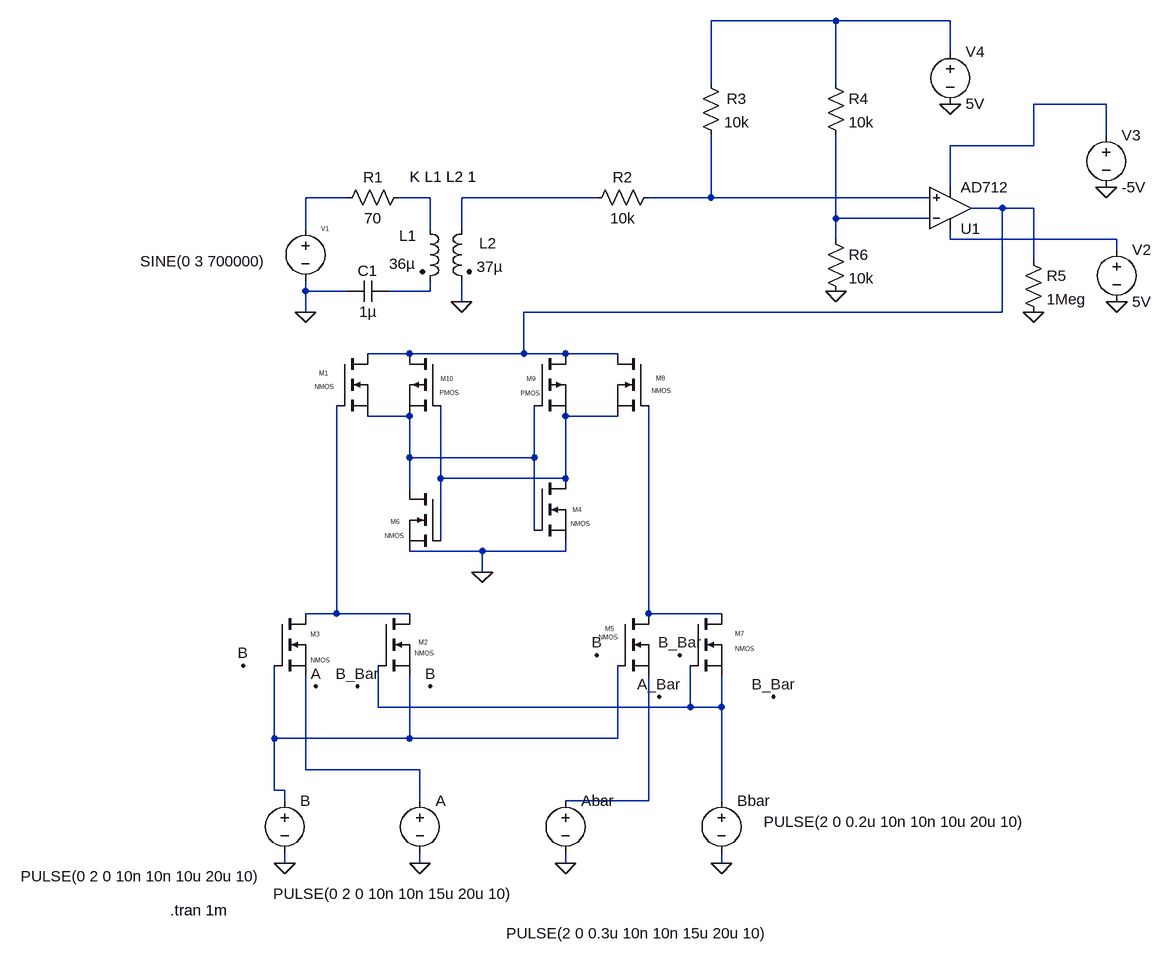
[diagram p0: schematic CPAL_wireless_sin.asc]
CPAL_wireless_sin.asc, the LTspice schematic file:
Version 4
SHEET 1 1252 1000
WIRE 672 -432 480 -432
WIRE 848 -432 672 -432
WIRE 848 -384 848 -432
WIRE 480 -336 480 -432
WIRE 672 -336 672 -432
WIRE 1088 -304 976 -304
WIRE 1088 -256 1088 -304
WIRE 976 -240 976 -304
WIRE 976 -240 848 -240
WIRE 848 -176 848 -240
WIRE -80 -160 -144 -160
WIRE 48 -160 0 -160
WIRE 304 -160 96 -160
WIRE 480 -160 480 -256
WIRE 480 -160 384 -160
WIRE 816 -160 480 -160
WIRE 928 -144 880 -144
WIRE 976 -144 928 -144
WIRE 672 -128 672 -256
WIRE 816 -128 672 -128
WIRE -144 -112 -144 -160
WIRE 48 -112 48 -160
WIRE 96 -112 96 -160
WIRE 672 -96 672 -128
WIRE 848 -96 848 -112
WIRE 1104 -96 848 -96
WIRE 1104 -80 1104 -96
WIRE 976 -64 976 -144
WIRE -144 -16 -144 -32
WIRE -80 -16 -144 -16
WIRE 48 -16 48 -32
WIRE 48 -16 -16 -16
WIRE 96 0 96 -32
WIRE -144 16 -144 -16
WIRE 928 16 928 -144
WIRE 928 16 192 16
WIRE 16 80 -48 80
WIRE 192 80 192 16
WIRE 192 80 16 80
WIRE 256 80 192 80
WIRE 336 80 256 80
WIRE 16 176 -48 176
WIRE 336 176 256 176
WIRE 16 240 16 176
WIRE 208 240 208 160
WIRE 208 240 16 240
WIRE 64 272 64 160
WIRE 256 272 256 176
WIRE 256 272 64 272
WIRE 16 288 16 240
WIRE 208 352 208 240
WIRE 64 368 64 272
WIRE 128 384 16 384
WIRE 256 384 256 368
WIRE 256 384 128 384
WIRE 128 416 128 384
WIRE -96 480 -96 160
WIRE -96 480 -144 480
WIRE 16 480 -96 480
WIRE 384 480 384 160
WIRE 496 480 384 480
WIRE -32 624 -32 560
WIRE 448 624 448 560
WIRE 448 624 -32 624
WIRE 496 624 496 576
WIRE 496 624 448 624
WIRE -192 672 -192 560
WIRE 16 672 16 576
WIRE 16 672 -192 672
WIRE 336 672 336 560
WIRE 336 672 16 672
WIRE -144 720 -144 576
WIRE 32 720 -144 720
WIRE -192 752 -192 672
WIRE -176 752 -192 752
WIRE -176 768 -176 752
WIRE 32 768 32 720
WIRE 384 768 384 576
WIRE 384 768 256 768
WIRE 496 768 496 624
WIRE -176 864 -176 848
WIRE 32 864 32 848
WIRE 256 864 256 848
WIRE 496 864 496 848
FLAG 128 416 0
FLAG 96 0 0
FLAG 400 608 A_Bar
FLAG 48 592 B
FLAG 576 608 B_Bar
FLAG 432 544 B_Bar
FLAG -64 592 B_Bar
FLAG -176 864 0
FLAG 496 864 0
FLAG -128 592 A
FLAG 304 544 B
FLAG 32 864 0
FLAG 256 864 0
FLAG -240 560 B
FLAG -144 16 0
FLAG 672 -16 0
FLAG 976 16 0
FLAG 848 -304 0
FLAG 1088 -176 0
FLAG 1104 0 0
SYMBOL nmos -96 80 R0
WINDOW 0 -27 30 Left 0
WINDOW 3 -34 51 Left 0
SYMATTR InstName M1
SYMBOL nmos -32 480 R0
WINDOW 0 62 44 Left 0
WINDOW 3 56 61 Left 0
SYMATTR InstName M2
SYMBOL nmos -192 480 R0
WINDOW 0 56 32 Left 0
WINDOW 3 56 72 Left 0
SYMATTR InstName M3
SYMBOL nmos 208 272 R0
WINDOW 0 59 48 Left 0
WINDOW 3 56 70 Left 0
SYMATTR InstName M4
SYMBOL nmos 336 480 R0
WINDOW 0 -19 23 Left 0
WINDOW 3 -29 36 Left 0
SYMATTR InstName M5
SYMBOL nmos 64 288 M0
WINDOW 0 63 51 Left 0
WINDOW 3 56 72 Left 0
SYMATTR InstName M6
SYMBOL nmos 448 480 R0
WINDOW 0 69 31 Left 0
WINDOW 3 69 54 Left 0
SYMATTR InstName M7
SYMBOL nmos 384 80 M0
WINDOW 0 -26 38 Left 0
WINDOW 3 -35 57 Left 0
SYMATTR InstName M8
SYMBOL pmos 208 80 R0
WINDOW 0 -12 39 Left 0
WINDOW 3 -21 61 Left 0
SYMATTR InstName M9
SYMBOL pmos 64 80 M0
WINDOW 0 -20 39 Left 0
WINDOW 3 -28 60 Left 0
SYMATTR InstName M10
SYMBOL voltage -144 -128 R0
WINDOW 0 24 16 Left 0
WINDOW 3 -254 66 Left 2
WINDOW 123 0 0 Left 0
WINDOW 39 0 0 Left 0
SYMATTR InstName V1
SYMATTR Value SINE(0 3 700000)
SYMBOL voltage -176 752 R0
WINDOW 123 0 0 Left 0
WINDOW 39 0 0 Left 0
WINDOW 3 -406 132 Left 2
SYMATTR Value PULSE(0 2 0 10n 10n 10u 20u 10)
SYMATTR InstName B
SYMBOL voltage 496 752 R0
WINDOW 123 0 0 Left 0
WINDOW 39 0 0 Left 0
WINDOW 3 65 48 Left 2
SYMATTR Value PULSE(2 0 0.2u 10n 10n 10u 20u 10)
SYMATTR InstName Bbar
SYMBOL voltage 32 752 R0
WINDOW 3 -226 159 Left 2
WINDOW 123 0 0 Left 0
WINDOW 39 0 0 Left 0
SYMATTR Value PULSE(0 2 0 10n 10n 15u 20u 10)
SYMATTR InstName A
SYMBOL voltage 256 752 R0
WINDOW 3 -91 220 Left 2
WINDOW 123 0 0 Left 0
WINDOW 39 0 0 Left 0
SYMATTR Value PULSE(2 0 0.3u 10n 10n 15u 20u 10)
SYMATTR InstName Abar
SYMBOL res 16 -176 R90
WINDOW 0 0 56 VBottom 2
WINDOW 3 32 56 VTop 2
SYMATTR InstName R1
SYMATTR Value 70
SYMBOL ind2 32 -128 R0
WINDOW 0 -32 27 Left 2
WINDOW 3 -47 70 Left 2
SYMATTR InstName L1
SYMATTR Value 36µ
SYMBOL ind2 112 -128 M0
WINDOW 0 -38 38 Left 2
WINDOW 3 -48 74 Left 2
SYMATTR InstName L2
SYMATTR Value 37µ
SYMBOL cap -16 -32 R90
WINDOW 0 0 32 VBottom 2
WINDOW 3 32 32 VTop 2
SYMATTR InstName C1
SYMATTR Value 1µ
SYMBOL res 400 -176 R90
WINDOW 0 0 56 VBottom 2
WINDOW 3 32 56 VTop 2
SYMATTR InstName R2
SYMATTR Value 10k
SYMBOL res 464 -352 R0
WINDOW 0 40 40 Left 2
SYMATTR InstName R3
SYMATTR Value 10k
SYMBOL res 656 -352 R0
SYMATTR InstName R4
SYMATTR Value 10k
SYMBOL res 960 -80 R0
SYMATTR InstName R5
SYMATTR Value 1Meg
SYMATTR SpiceLine tol=1 pwr=0.1
SYMBOL res 656 -112 R0
SYMATTR InstName R6
SYMATTR Value 10k
SYMBOL OpAmps\\AD712 848 -80 M180
SYMATTR InstName U1
SYMBOL voltage 1104 -96 R0
WINDOW 123 0 0 Left 0
WINDOW 39 0 0 Left 0
SYMATTR InstName V2
SYMATTR Value 5V
SYMBOL voltage 1088 -272 R0
WINDOW 123 0 0 Left 0
WINDOW 39 0 0 Left 0
SYMATTR InstName V3
SYMATTR Value -5V
SYMBOL voltage 848 -400 R0
WINDOW 123 0 0 Left 0
WINDOW 39 0 0 Left 0
SYMATTR InstName V4
SYMATTR Value 5V
TEXT -352 936 Left 2 !.tran 1m
TEXT 16 -192 Left 2 !K L1 L2 1

The netlist it stands for:
* CPAL_wireless_sin.asc
M1 N007 N013 N011 N011 NMOS
M2 N013 N015 N016 N016 NMOS
M3 N013 N016 N017 N017 NMOS
M4 N012 N011 0 0 NMOS
M5 N014 N016 N018 N018 NMOS
M6 N011 N012 0 0 NMOS
M7 N014 N015 N015 N015 NMOS
M8 N007 N014 N012 N012 NMOS
M9 N007 N011 N012 N012 PMOS
M10 N007 N012 N011 N011 PMOS
V1 N003 0 SINE(0 3 700000)
V§B N016 0 PULSE(0 2 0 10n 10n 10u 20u 10)
V§Bbar N015 0 PULSE(2 0 0.2u 10n 10n 10u 20u 10)
V§A N017 0 PULSE(0 2 0 10n 10n 15u 20u 10)
V§Abar N018 0 PULSE(2 0 0.3u 10n 10n 15u 20u 10)
R1 N004 N003 70
L1 N004 N010 36µ
L2 N005 0 37µ
C1 N010 0 1µ
R2 N006 N005 10k
R3 N001 N006 10k
R4 N001 N008 10k
R5 N007 0 1Meg tol=1 pwr=0.1
R6 N008 0 10k
XU1 N006 N008 N009 N002 N007 AD712  ; pins In+ In- V+ V- OUT
V2 N009 0 5V
V3 N002 0 -5V
V4 N001 0 5V
.model NMOS NMOS
.model PMOS PMOS
.lib standard.mos
.tran 1m
K L1 L2 1
.backanno
.end